# Altium schematic sheet LPCB280 - DRIVERS.SchDoc
size A3; Address1: Factory 10; Address2: 9-13 Dingley Avenue, Dandeong, VICTORIA 3175, AUSTRALIA; DocumentNumber: 3; Revision: 1; SheetNumber: 3; SheetTotal: 6; Lockie__PCB_SUB_ASSEMBLY: PCB Sub Component; Lockie__PCB_ASSEMBLY: PCB Assembly; Lockie__LDL: LPCB280; Lockie__PCB_DESCRIPTION: Gimbal Control Unit (GCU)
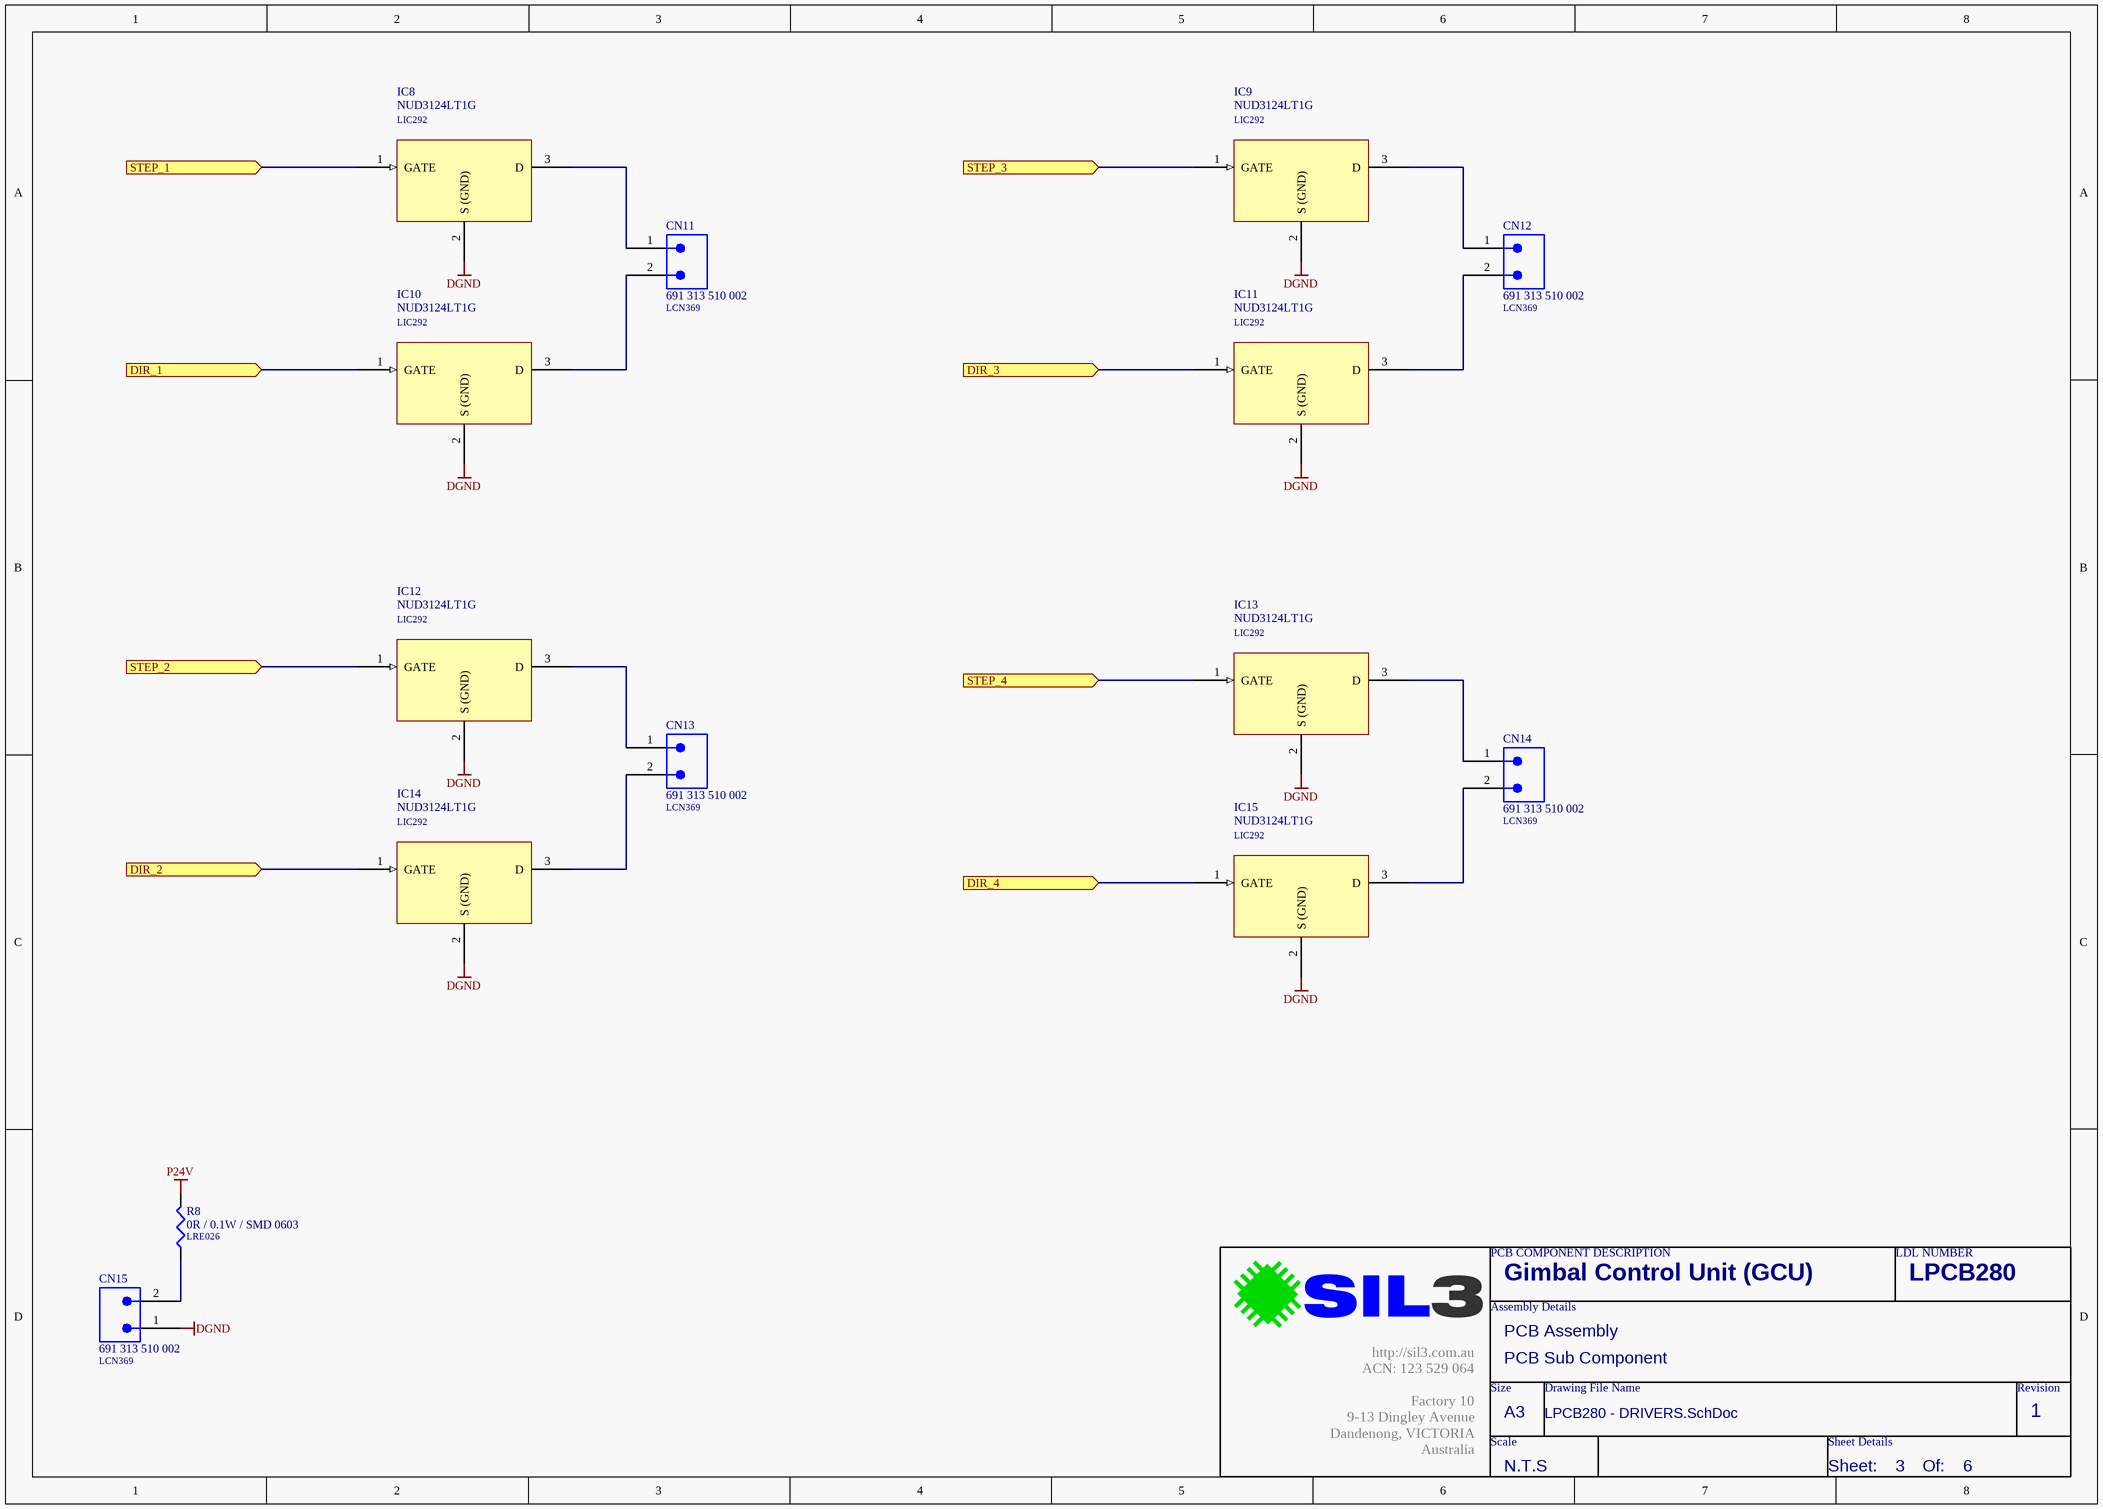
[diagram p0: LPCB280 - DRIVERS.SchDoc]

## Parts
CN11  691 313 510 002  LDL_NUMBER: LCN369  [691 313 510 002]
CN12  691 313 510 002  LDL_NUMBER: LCN369  [691 313 510 002]
CN13  691 313 510 002  LDL_NUMBER: LCN369  [691 313 510 002]
CN14  691 313 510 002  LDL_NUMBER: LCN369  [691 313 510 002]
CN15  691 313 510 002  LDL_NUMBER: LCN369  [691 313 510 002]
IC8  NUD3124LT1G  LDL_NUMBER: LIC292  [LFP021__SOT23]
IC9  NUD3124LT1G  LDL_NUMBER: LIC292  [LFP021__SOT23]
IC10  NUD3124LT1G  LDL_NUMBER: LIC292  [LFP021__SOT23]
IC11  NUD3124LT1G  LDL_NUMBER: LIC292  [LFP021__SOT23]
IC12  NUD3124LT1G  LDL_NUMBER: LIC292  [LFP021__SOT23]
IC13  NUD3124LT1G  LDL_NUMBER: LIC292  [LFP021__SOT23]
IC14  NUD3124LT1G  LDL_NUMBER: LIC292  [LFP021__SOT23]
IC15  NUD3124LT1G  LDL_NUMBER: LIC292  [LFP021__SOT23]
R8  0R / 0.1W / SMD 0603  LDL_NUMBER: LRE026  [LFP020__CR1608-0603-IPC7351_B]

## Ports
DIR_1 (in), DIR_2 (in), DIR_3 (in), DIR_4 (in), STEP_1 (in), STEP_2 (in), STEP_3 (in), STEP_4 (in)

## Nets
DGND: CN15.1 IC8.2(S_(GND)) IC9.2(S_(GND)) IC10.2(S_(GND)) IC11.2(S_(GND)) IC12.2(S_(GND)) IC13.2(S_(GND)) IC14.2(S_(GND)) IC15.2(S_(GND))
P24V: R8.2
DIR_1: IC10.1(GATE) ; port DIR_1
DIR_2: IC14.1(GATE) ; port DIR_2
DIR_3: IC11.1(GATE) ; port DIR_3
DIR_4: IC15.1(GATE) ; port DIR_4
STEP_1: IC8.1(GATE) ; port STEP_1
STEP_2: IC12.1(GATE) ; port STEP_2
STEP_3: IC9.1(GATE) ; port STEP_3
STEP_4: IC13.1(GATE) ; port STEP_4
NetCN11_1: CN11.1 IC8.3(D)
NetCN11_2: CN11.2 IC10.3(D)
NetCN12_1: CN12.1 IC9.3(D)
NetCN12_2: CN12.2 IC11.3(D)
NetCN13_1: CN13.1 IC12.3(D)
NetCN13_2: CN13.2 IC14.3(D)
NetCN14_1: CN14.1 IC13.3(D)
NetCN14_2: CN14.2 IC15.3(D)
NetCN15_2: CN15.2 R8.1

## Notes on the sheet
- PCB COMPONENT DESCRIPTION
- LDL NUMBER
- Assembly Details
- Size
- Drawing File Name
- Revision
- http://sil3.com.au
  ACN: 123 529 064
  Factory 10
  9-13 Dingley Avenue
  Dandenong, VICTORIA
  Australia
- Scale
- A3
- Sheet Details
- N.T.S
- Sheet:
- Of:

## Library data of the parts
CN11-CN15 = 691 313 510 002: Connector, Pluggable Terminal Block, 5.08mm, 2 Way, PTH; FMEDA__CHANNEL: COM; FMEDA__OPERATING__CURRENT_MAX: 0; FMEDA__OPERATING__TEMP_MAX: 50; FMEDA__OPERATING__TEMP_MIN: -20; FMEDA__OPERATING__TEMP_TYP: 27; FMEDA__OPERATING__VOLTAGE_MAX: 16; FMEDA__OPERATING__VOLTAGE_TYP: 12; FMEDA__FUNCTION_IN_SYSTEM: *; FMEDA__OPERATING__CURRENT_MIN: 0; FMEDA__OPERATING__CURRENT_TYP: 0; FMEDA__OPERATING__VOLTAGE_MIN: 0
IC8-IC15 = NUD3124LT1G: IC, Relay Driver, 28V Industrial, SMD SOT23 [LIC292]; FMEDA__OPERATING__TEMP_MIN: -20; FMEDA__OPERATING__TEMP_TYP: 27; FMEDA__OPERATING__TEMP_MAX: 50; FMEDA__OPERATING__VOLTAGE_MIN: 0; FMEDA__OPERATING__VOLTAGE_TYP: 13; FMEDA__OPERATING__VOLTAGE_MAX: 18; FMEDA__OPERATING__POWER_TYP: 0.1; FMEDA__OPERATING__POWER_MAX: 0.15; FMEDA__CHANNEL: COM; FMEDA__FUNCTION_IN_SYSTEM: *; FMEDA__OPERATING__POWER_MIN: 0
R8 = 0R / 0.1W / SMD 0603: Resistor, Ceramic Chip, 0R, 0.1W, SMD 0603 [LRE026]; Value: 0; FMEDA__OPERATING__TEMP_MAX: 50; FMEDA__OPERATING__TEMP_MIN: -20; FMEDA__OPERATING__TEMP_TYP: 27; FMEDA__CHANNEL: COM; FMEDA__OPERATING__POWER_MAX: 0; FMEDA__OPERATING__POWER_MIN: 0; FMEDA__OPERATING__VOLTAGE_MAX: 0; FMEDA__OPERATING__VOLTAGE_MIN: 0; FMEDA__OPERATING__VOLTAGE_TYP: 0; FMEDA__FUNCTION_IN_SYSTEM: *